# Altium project PowerSupplyPCB.PrjPcb
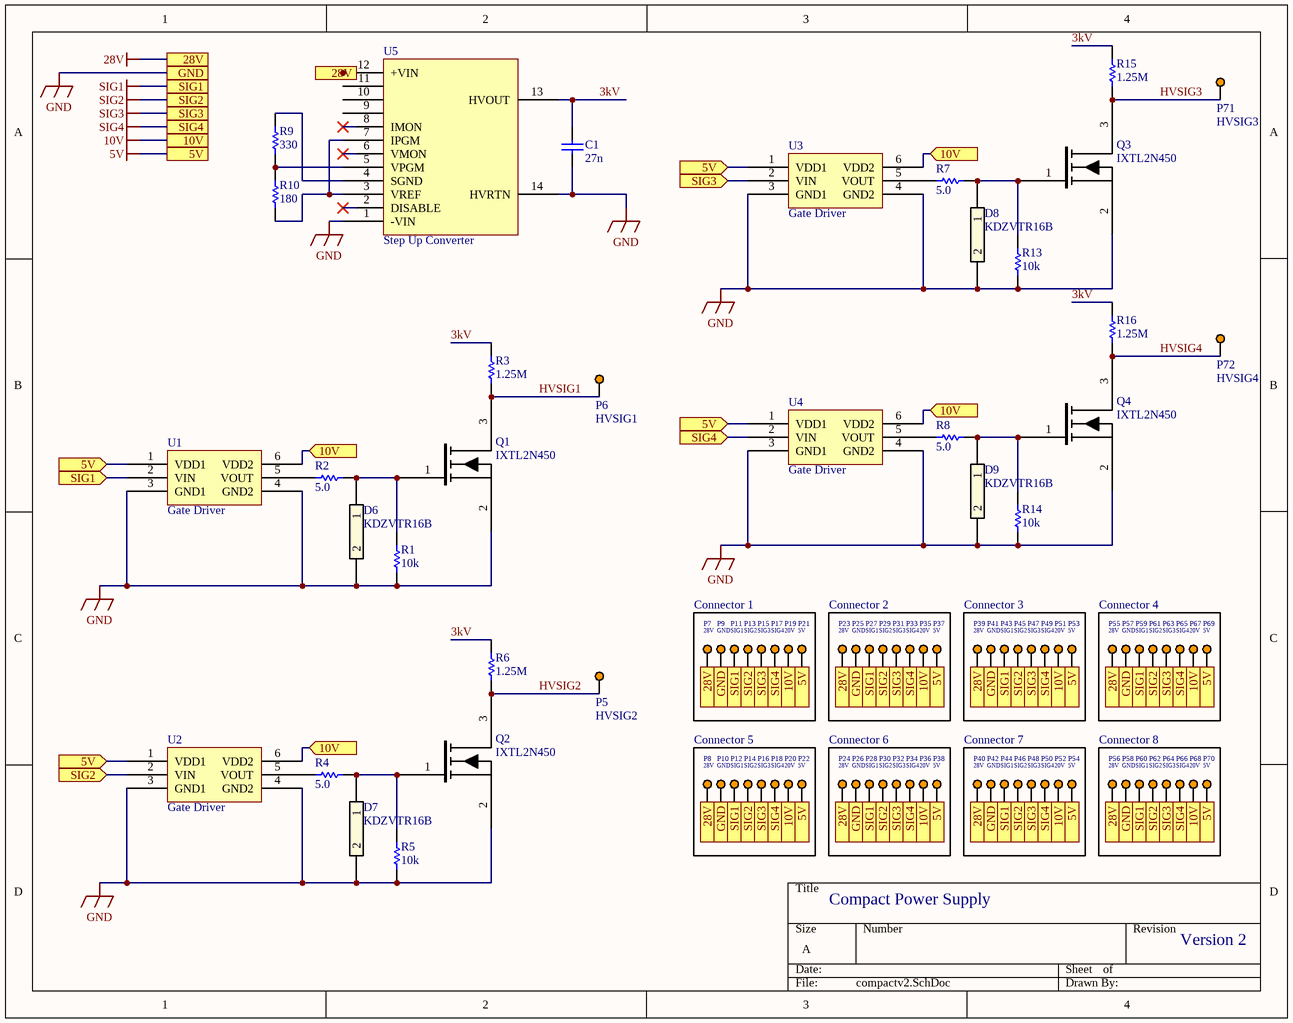
[diagram p0: compactv2.SchDoc]
3 sheets, 325 parts. Net scope: hierarchical (ports join the sheet entries above them; power ports are global).
Board files: benchtopv2-5.PcbDoc, compactv2.PcbDoc, benchtopv4.PcbDoc, compactv2-5_changed.PcbDoc, compactv2-5.PcbDoc
Sheets:
  compactv2.SchDoc
  benchtopv2.SchDoc
  compactv2-5.SchDoc

## Sheet compactv2.SchDoc
size A; SheetNumber: 1; SheetTotal: 3

### Parts
(Parts that share a designator on the sheet are numbered #1, #2 ... from top to bottom, then left to right.)
C1#1  27n  [HV Capacitor]
D6  KDZVTR16B  [Zener Diode]
D7  KDZVTR16B  [Zener Diode]
D8  KDZVTR16B  [Zener Diode]
D9  KDZVTR16B  [Zener Diode]
P5#1  HVSIG2  [Via]
P6#1  HVSIG1  [Via]
P7#1  28V  [Via]
P8#1  28V  [Via]
P9#1  GND  [Via]
P10#1  GND  [Via]
P11#1  SIG1  [Via]
P12#1  SIG1  [Via]
P13#1  SIG2  [Via]
P14#1  SIG2  [Via]
P15#1  SIG3  [Via]
P16#1  SIG3  [Via]
P17#1  SIG4  [Via]
P18#1  SIG4  [Via]
P19#1  20V  [Via]
P20#1  20V  [Via]
P21#1  5V  [Via]
P22#1  5V  [Via]
P23#1  28V  [Via]
P24#1  28V  [Via]
P25#1  GND  [Via]
P26#1  GND  [Via]
P27#1  SIG1  [Via]
P28#1  SIG1  [Via]
P29#1  SIG2  [Via]
P30#1  SIG2  [Via]
P31#1  SIG3  [Via]
P32#1  SIG3  [Via]
P33#1  SIG4  [Via]
P34#1  SIG4  [Via]
P35#1  20V  [Via]
P36#1  20V  [Via]
P37#1  5V  [Via]
P38#1  5V  [Via]
P39#1  28V  [Via]
P40#1  28V  [Via]
P41#1  GND  [Via]
P42#1  GND  [Via]
P43#1  SIG1  [Via]
P44#1  SIG1  [Via]
P45#1  SIG2  [Via]
P46#1  SIG2  [Via]
P47#1  SIG3  [Via]
P48#1  SIG3  [Via]
P49#1  SIG4  [Via]
P50#1  SIG4  [Via]
P51#1  20V  [Via]
P52#1  20V  [Via]
P53#1  5V  [Via]
P54#1  5V  [Via]
P55#1  28V  [Via]
P56#1  28V  [Via]
P57#1  GND  [Via]
P58#1  GND  [Via]
P59#1  SIG1  [Via]
P60#1  SIG1  [Via]
P61#1  SIG2  [Via]
P62#1  SIG2  [Via]
P63#1  SIG3  [Via]
P64#1  SIG3  [Via]
P65#1  SIG4  [Via]
P66#1  SIG4  [Via]
P67#1  20V  [Via]
P68#1  20V  [Via]
P69#1  5V  [Via]
P70#1  5V  [Via]
P71#1  HVSIG3  [Via]
P72#1  HVSIG4  [Via]
Q1#1  IXTL2N450  [MOSFET]
Q2#1  IXTL2N450  [MOSFET]
Q3#1  IXTL2N450  [MOSFET]
Q4#1  IXTL2N450  [MOSFET]
R1#1  10k  [LV Resistor]
R2#1  5.0  [Zener Resistor]
R3#1  1.25M  [LV Resistor]
R4#1  5.0  [Zener Resistor]
R5#1  10k  [LV Resistor]
R6#1  1.25M  [LV Resistor]
R7#1  5.0  [Zener Resistor]
R8#1  5.0  [Zener Resistor]
R9#1  330  [LV Resistor]
R10#1  180  [LV Resistor]
R13#1  10k  [LV Resistor]
R14#1  10k  [LV Resistor]
R15  1.25M  [LV Resistor]
R16  1.25M  [LV Resistor]
U1#1  Gate Driver  [Gate Driver]
U2#1  Gate Driver  [Gate Driver]
U3#1  Gate Driver  [Gate Driver]
U4#1  Gate Driver  [Gate Driver]
U5#1  Step Up Converter  [Step Up Converter]

### Blocks framed on the sheet
Connector 1: P7#1 P9#1 P11#1 P13#1 P15#1 P17#1 P19#1 P21#1
Connector 2: P23#1 P25#1 P27#1 P29#1 P31#1 P33#1 P35#1 P37#1
Connector 3: P39#1 P41#1 P43#1 P45#1 P47#1 P49#1 P51#1 P53#1
Connector 4: P55#1 P57#1 P59#1 P61#1 P63#1 P65#1 P67#1 P69#1
Connector 5: P8#1 P10#1 P12#1 P14#1 P16#1 P18#1 P20#1 P22#1
Connector 6: P24#1 P26#1 P28#1 P30#1 P32#1 P34#1 P36#1 P38#1
Connector 7: P40#1 P42#1 P44#1 P46#1 P48#1 P50#1 P52#1 P54#1
Connector 8: P56#1 P58#1 P60#1 P62#1 P64#1 P66#1 P68#1 P70#1

### Ports
5V, 5V (in), 10V, 10V (in), 28V, GND, SIG1, SIG1 (in), SIG2, SIG2 (in), SIG3, SIG3 (in), SIG4, SIG4 (in)

### Nets
5V: U1#1.1(VDD1) U2#1.1(VDD1) U3#1.1(VDD1) U4#1.1(VDD1) ; port 5V
10V: U1#1.6(VDD2) U2#1.6(VDD2) U3#1.6(VDD2) U4#1.6(VDD2) ; port 10V
28V: port 28V
GND: C1#1.1 D6.2 D7.2 D8.2 D9.2 Q1#1.2(S) Q2#1.2(S) Q3#1.2(S) Q4#1.2(S) R1#1.1 R5#1.1 R13#1.1 R14#1.1 U1#1.3(GND1) U1#1.4(GND2) U2#1.3(GND1) U2#1.4(GND2) U3#1.3(GND1) U3#1.4(GND2) U4#1.3(GND1) U4#1.4(GND2) U5#1.1(-VIN) U5#1.14(HVRTN) ; port GND
SIG1: U1#1.2(VIN) ; port SIG1
SIG2: U2#1.2(VIN) ; port SIG2
SIG3: U3#1.2(VIN) ; port SIG3
SIG4: U4#1.2(VIN) ; port SIG4
3kV: C1#1.2 R3#1.1 R6#1.1 R15.1 R16.1 U5#1.13(HVOUT)
HVSIG1: Q1#1.3(D) R3#1.2
HVSIG2: Q2#1.3(D) R6#1.2
HVSIG3: Q3#1.3(D) R15.2
HVSIG4: Q4#1.3(D) R16.2
NetD6_1: D6.1 Q1#1.1(G) R1#1.2 R2#1.1
NetD7_1: D7.1 Q2#1.1(G) R4#1.1 R5#1.2
NetD8_1: D8.1 Q3#1.1(G) R7#1.1 R13#1.2
NetD9_1: D9.1 Q4#1.1(G) R8#1.1 R14#1.2
NetR2#1_2: R2#1.2 U1#1.5(VOUT)
NetR4#1_2: R4#1.2 U2#1.5(VOUT)
NetR7#1_2: R7#1.2 U3#1.5(VOUT)
NetR8#1_2: R8#1.2 U4#1.5(VOUT)
NetR9#1_1: R9#1.1 U5#1.4(SGND)
NetR9#1_2: R9#1.2 R10#1.1 U5#1.5(VPGM)
NetR10#1_2: R10#1.2 U5#1.3(VREF) U5#1.7(IPGM)

Not connected (* = marked no-connect by the designer): P5#1 1; P6#1 1; P7#1 1; P8#1 1; P9#1 1; P10#1 1; P11#1 1; P12#1 1; P13#1 1; P14#1 1; P15#1 1; P16#1 1; P17#1 1; P18#1 1; P19#1 1; P20#1 1; P21#1 1; P22#1 1; P23#1 1; P24#1 1; P25#1 1; P26#1 1; P27#1 1; P28#1 1; P29#1 1; P30#1 1; P31#1 1; P32#1 1; P33#1 1; P34#1 1; P35#1 1; P36#1 1; P37#1 1; P38#1 1; P39#1 1; P40#1 1; P41#1 1; P42#1 1; P43#1 1; P44#1 1; P45#1 1; P46#1 1; P47#1 1; P48#1 1; P49#1 1; P50#1 1; P51#1 1; P52#1 1; P53#1 1; P54#1 1; P55#1 1; P56#1 1; P57#1 1; P58#1 1; P59#1 1; P60#1 1; P61#1 1; P62#1 1; P63#1 1; P64#1 1; P65#1 1; P66#1 1; P67#1 1; P68#1 1; P69#1 1; P70#1 1; P71#1 1; P72#1 1; U5#1 2(DISABLE)* 6(VMON)* 8(IMON)* 9 10 11 12(+VIN)

### Notes on the sheet
- Compact Power Supply
- Version 2

### Library data of the parts
C1#1 = Capacitor
D6-D9 = Zener Diode: Vendor: ROHM Semiconductor; Built_By: EMA_Matt; SourceLibrary: Rohm_2019-09-23; Type: DEV; Manufacturer_Part_Number: KDZVTR16B; Copyright: Copyright (C) 2018 Accelerated Designs. All rights reserved; RefDes: RefDes
P5#1 P6#1 P7#1 P8#1 P9#1 P10#1 P11#1 P12#1 P13#1 P14#1 P15#1 P16#1 P17#1 P18#1 P19#1 P20#1 P21#1 P22#1 P23#1 P24#1 P25#1 P26#1 P27#1 P28#1 P29#1 P30#1 P31#1 P32#1 P33#1 P34#1 P35#1 P36#1 P37#1 P38#1 P39#1 P40#1 P41#1 P42#1 P43#1 P44#1 P45#1 P46#1 P47#1 P48#1 P49#1 P50#1 P51#1 P52#1 P53#1 P54#1 P55#1 P56#1 P57#1 P58#1 P59#1 P60#1 P61#1 P62#1 P63#1 P64#1 P65#1 P66#1 P67#1 P68#1 P69#1 P70#1 P71#1 P72#1 = Output Point: Thru hole via
Q1#1 Q2#1 Q3#1 Q4#1 = MOSFET: IXTL2N4X0
R1#1 R2#1 R3#1 R4#1 R5#1 R6#1 R7#1 R8#1 R9#1 R10#1 R13#1 R14#1 R15 R16 = Resistor
U1#1 U2#1 U3#1 U4#1 = Gate Driver: ADuM4120
U5#1 = Step Up Converter: HRL30

## Sheet benchtopv2.SchDoc
size A; SheetNumber: 2; SheetTotal: 2
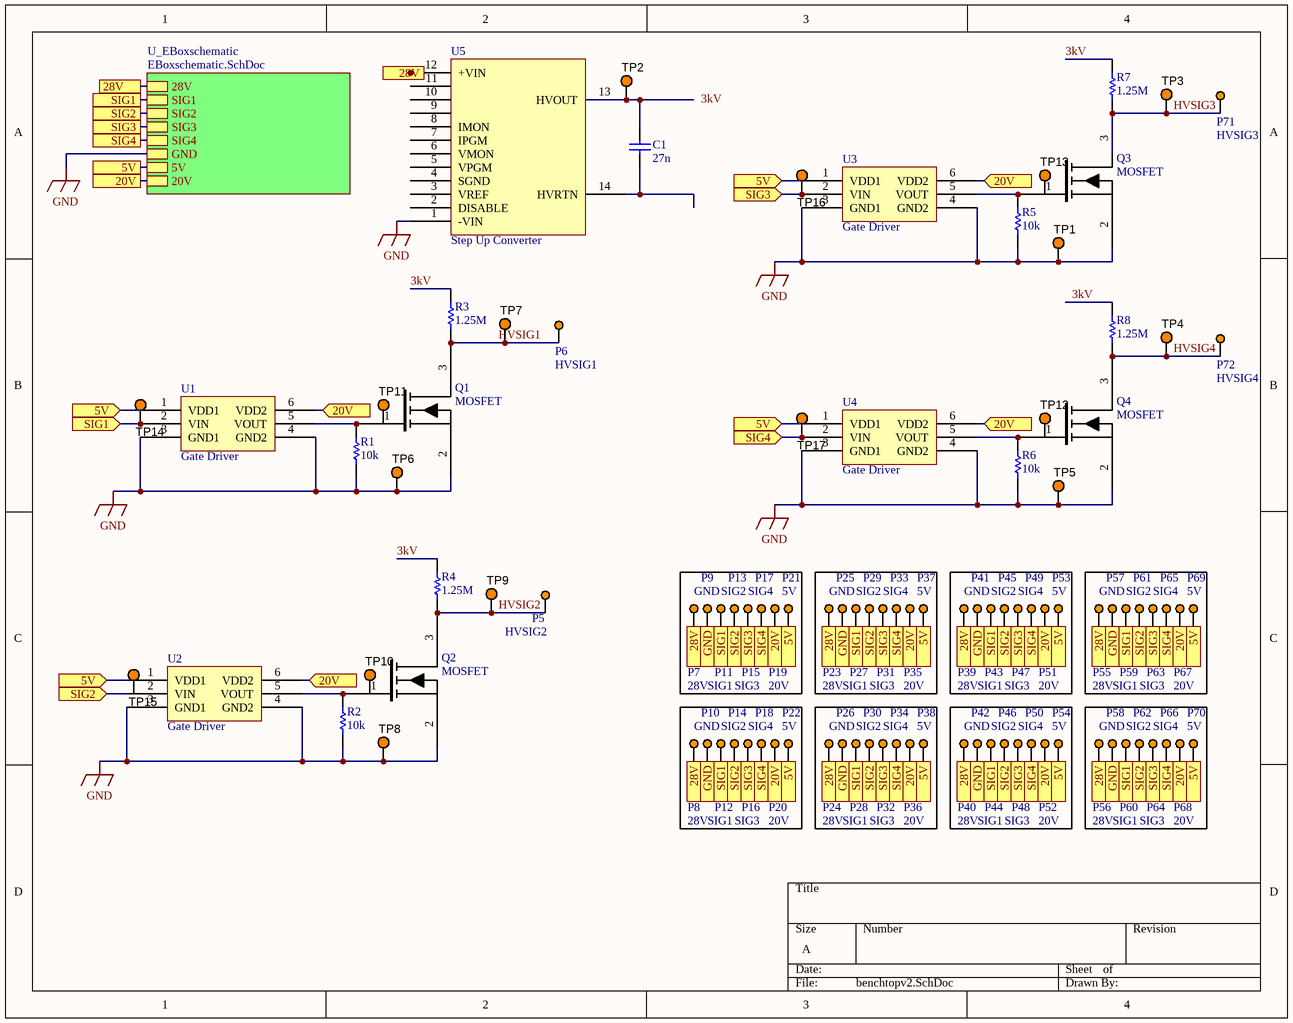
[diagram p1: benchtopv2.SchDoc]

### Parts
(Parts that share a designator on the sheet are numbered #1, #2 ... from top to bottom, then left to right.)
C1#2  27n  [HV Capacitor]
P5#2  HVSIG2  [Via]
P6#2  HVSIG1  [Via]
P7#2  28V  [Via]
P8#2  28V  [Via]
P9#2  GND  [Via]
P10#2  GND  [Via]
P11#2  SIG1  [Via]
P12#2  SIG1  [Via]
P13#2  SIG2  [Via]
P14#2  SIG2  [Via]
P15#2  SIG3  [Via]
P16#2  SIG3  [Via]
P17#2  SIG4  [Via]
P18#2  SIG4  [Via]
P19#2  20V  [Via]
P20#2  20V  [Via]
P21#2  5V  [Via]
P22#2  5V  [Via]
P23#2  28V  [Via]
P24#2  28V  [Via]
P25#2  GND  [Via]
P26#2  GND  [Via]
P27#2  SIG1  [Via]
P28#2  SIG1  [Via]
P29#2  SIG2  [Via]
P30#2  SIG2  [Via]
P31#2  SIG3  [Via]
P32#2  SIG3  [Via]
P33#2  SIG4  [Via]
P34#2  SIG4  [Via]
P35#2  20V  [Via]
P36#2  20V  [Via]
P37#2  5V  [Via]
P38#2  5V  [Via]
P39#2  28V  [Via]
P40#2  28V  [Via]
P41#2  GND  [Via]
P42#2  GND  [Via]
P43#2  SIG1  [Via]
P44#2  SIG1  [Via]
P45#2  SIG2  [Via]
P46#2  SIG2  [Via]
P47#2  SIG3  [Via]
P48#2  SIG3  [Via]
P49#2  SIG4  [Via]
P50#2  SIG4  [Via]
P51#2  20V  [Via]
P52#2  20V  [Via]
P53#2  5V  [Via]
P54#2  5V  [Via]
P55#2  28V  [Via]
P56#2  28V  [Via]
P57#2  GND  [Via]
P58#2  GND  [Via]
P59#2  SIG1  [Via]
P60#2  SIG1  [Via]
P61#2  SIG2  [Via]
P62#2  SIG2  [Via]
P63#2  SIG3  [Via]
P64#2  SIG3  [Via]
P65#2  SIG4  [Via]
P66#2  SIG4  [Via]
P67#2  20V  [Via]
P68#2  20V  [Via]
P69#2  5V  [Via]
P70#2  5V  [Via]
P71#2  HVSIG3  [Via]
P72#2  HVSIG4  [Via]
Q1#2  MOSFET  [MOSFET]
Q2#2  MOSFET  [MOSFET]
Q3#2  MOSFET  [MOSFET]
Q4#2  MOSFET  [MOSFET]
R1#2  10k  [LV Resistor]
R2#2  10k  [LV Resistor]
R3#2  1.25M  [HV resistor]
R4#2  1.25M  [HV resistor]
R5#2  10k  [LV Resistor]
R6#2  10k  [LV Resistor]
R7#2  1.25M  [HV resistor]
R8#2  1.25M  [HV resistor]
TP1  5003  [KSTN-5003]  (value not drawn)
TP2  5003  [KSTN-5003]  (value not drawn)
TP3  5003  [KSTN-5003]  (value not drawn)
TP4  5003  [KSTN-5003]  (value not drawn)
TP5  5003  [KSTN-5003]  (value not drawn)
TP6  5003  [KSTN-5003]  (value not drawn)
TP7  5003  [KSTN-5003]  (value not drawn)
TP8  5003  [KSTN-5003]  (value not drawn)
TP9  5003  [KSTN-5003]  (value not drawn)
TP10  5003  [KSTN-5003]  (value not drawn)
TP11  5003  [KSTN-5003]  (value not drawn)
TP12  5003  [KSTN-5003]  (value not drawn)
TP13  5003  [KSTN-5003]  (value not drawn)
TP14  5003  [KSTN-5003]  (value not drawn)
TP15  5003  [KSTN-5003]  (value not drawn)
TP16  5003  [KSTN-5003]  (value not drawn)
TP17  5003  [KSTN-5003]  (value not drawn)
U1#2  Gate Driver  [Gate Driver]
U2#2  Gate Driver  [Gate Driver]
U3#2  Gate Driver  [Gate Driver]
U4#2  Gate Driver  [Gate Driver]
U5#2  Step Up Converter  [Step Up Converter]

### Sub-sheets
U_EBoxschematic = EBoxschematic.SchDoc (file not in this document): 28V, SIG1, SIG2, SIG3, SIG4, GND, 5V, 20V

### Ports
5V, 5V (in), 20V, 20V (in), 28V, GND, SIG1, SIG1 (in), SIG2, SIG2 (in), SIG3, SIG3 (in), SIG4, SIG4 (in)

### Nets
GND: Q1#2.2(S) Q2#2.2(S) Q3#2.2(S) Q4#2.2(S) R1#2.1 R2#2.1 R5#2.1 R6#2.1 TP1.1 TP5.1 TP6.1 TP8.1 U1#2.3(GND1) U1#2.4(GND2) U2#2.3(GND1) U2#2.4(GND2) U3#2.3(GND1) U3#2.4(GND2) U4#2.3(GND1) U4#2.4(GND2) U5#2.1(-VIN) ; sheet U_EBoxschematic/GND
3kV: R3#2.1 R4#2.1 R7#2.1 R8#2.1
HVSIG1: Q1#2.3(D) R3#2.2 TP7.1
HVSIG2: Q2#2.3(D) R4#2.2 TP9.1
HVSIG3: Q3#2.3(D) R7#2.2 TP3.1
HVSIG4: Q4#2.3(D) R8#2.2 TP4.1
NetC1#2_1: C1#2.1 U5#2.14(HVRTN)
NetC1#2_2: C1#2.2 TP2.1 U5#2.13(HVOUT)
NetQ1#2_1: Q1#2.1(G) R1#2.2 U1#2.5(VOUT)
NetQ2#2_1: Q2#2.1(G) R2#2.2 U2#2.5(VOUT)
NetQ3#2_1: Q3#2.1(G) R5#2.2 U3#2.5(VOUT)
NetQ4#2_1: Q4#2.1(G) R6#2.2 U4#2.5(VOUT)
NetTP14_1: TP14.1 U1#2.2(VIN) ; port SIG1, sheet U_EBoxschematic/SIG1
NetTP16_1: TP16.1 U3#2.2(VIN) ; port SIG3, sheet U_EBoxschematic/SIG3
NetTP17_1: TP17.1 U4#2.2(VIN) ; port SIG4, sheet U_EBoxschematic/SIG4
NetU1#2_1: U1#2.1(VDD1) U2#2.1(VDD1) U3#2.1(VDD1) U4#2.1(VDD1) ; port 5V, sheet U_EBoxschematic/5V
NetU1#2_6: U1#2.6(VDD2) U2#2.6(VDD2) U3#2.6(VDD2) U4#2.6(VDD2) ; port 20V, sheet U_EBoxschematic/20V
NetU2#2_2: U2#2.2(VIN) ; port SIG2, sheet U_EBoxschematic/SIG2
(unnamed): port 28V, sheet U_EBoxschematic/28V

Not connected (* = marked no-connect by the designer): P5#2 1; P6#2 1; P7#2 1; P8#2 1; P9#2 1; P10#2 1; P11#2 1; P12#2 1; P13#2 1; P14#2 1; P15#2 1; P16#2 1; P17#2 1; P18#2 1; P19#2 1; P20#2 1; P21#2 1; P22#2 1; P23#2 1; P24#2 1; P25#2 1; P26#2 1; P27#2 1; P28#2 1; P29#2 1; P30#2 1; P31#2 1; P32#2 1; P33#2 1; P34#2 1; P35#2 1; P36#2 1; P37#2 1; P38#2 1; P39#2 1; P40#2 1; P41#2 1; P42#2 1; P43#2 1; P44#2 1; P45#2 1; P46#2 1; P47#2 1; P48#2 1; P49#2 1; P50#2 1; P51#2 1; P52#2 1; P53#2 1; P54#2 1; P55#2 1; P56#2 1; P57#2 1; P58#2 1; P59#2 1; P60#2 1; P61#2 1; P62#2 1; P63#2 1; P64#2 1; P65#2 1; P66#2 1; P67#2 1; P68#2 1; P69#2 1; P70#2 1; P71#2 1; P72#2 1; TP10 1; TP11 1; TP12 1; TP13 1; TP15 1; U5#2 2(DISABLE) 3(VREF) 4(SGND) 5(VPGM) 6(VMON) 7(IPGM) 8(IMON) 9 10 11 12(+VIN)

### Notes on the sheet
- Labels drawn without touching a wire or pin: 3kV

### Library data of the parts
C1#2 = Capacitor
P5#2 P6#2 P7#2 P8#2 P9#2 P10#2 P11#2 P12#2 P13#2 P14#2 P15#2 P16#2 P17#2 P18#2 P19#2 P20#2 P21#2 P22#2 P23#2 P24#2 P25#2 P26#2 P27#2 P28#2 P29#2 P30#2 P31#2 P32#2 P33#2 P34#2 P35#2 P36#2 P37#2 P38#2 P39#2 P40#2 P41#2 P42#2 P43#2 P44#2 P45#2 P46#2 P47#2 P48#2 P49#2 P50#2 P51#2 P52#2 P53#2 P54#2 P55#2 P56#2 P57#2 P58#2 P59#2 P60#2 P61#2 P62#2 P63#2 P64#2 P65#2 P66#2 P67#2 P68#2 P69#2 P70#2 P71#2 P72#2 = Output Point: Thru hole via
Q1#2 Q2#2 Q3#2 Q4#2 = MOSFET: IXTL2N4X0
R1#2 R2#2 R3#2 R4#2 R5#2 R6#2 R7#2 R8#2 = Resistor
TP1-TP17 = CMP-002-00037-2: Test Point, Orange, Height 4.6 mm, Tail Length 3 mm, 1-Pin THD, RoHS; Manufacturer: Keystone; Colour: Orange; Packaging: Bulk; Package Description: 1-Pin Through Hole Device, Dia 2.54 mm; Pins: 1; Package Reference: 5003; Datasheet Version: Jun-15; Case/Package: 5003; Mounting Technology: TH; Connector Type: TestPoint; Diameter: 2.54mm; Contact Material: Bronze; Datasheet URL: http://keyelco.com/userAssets/file/M65p56.pdf; Manufacturer URL: http://www.keyelco.com/; Package Quantity: 10; Contact Plating: Tin; RoHS Compliant: True
U1#2 U2#2 U3#2 U4#2 = Gate Driver: ADuM4120
U5#2 = Step Up Converter: HRL30

## Sheet compactv2-5.SchDoc
size A; SheetNumber: 3; SheetTotal: 3
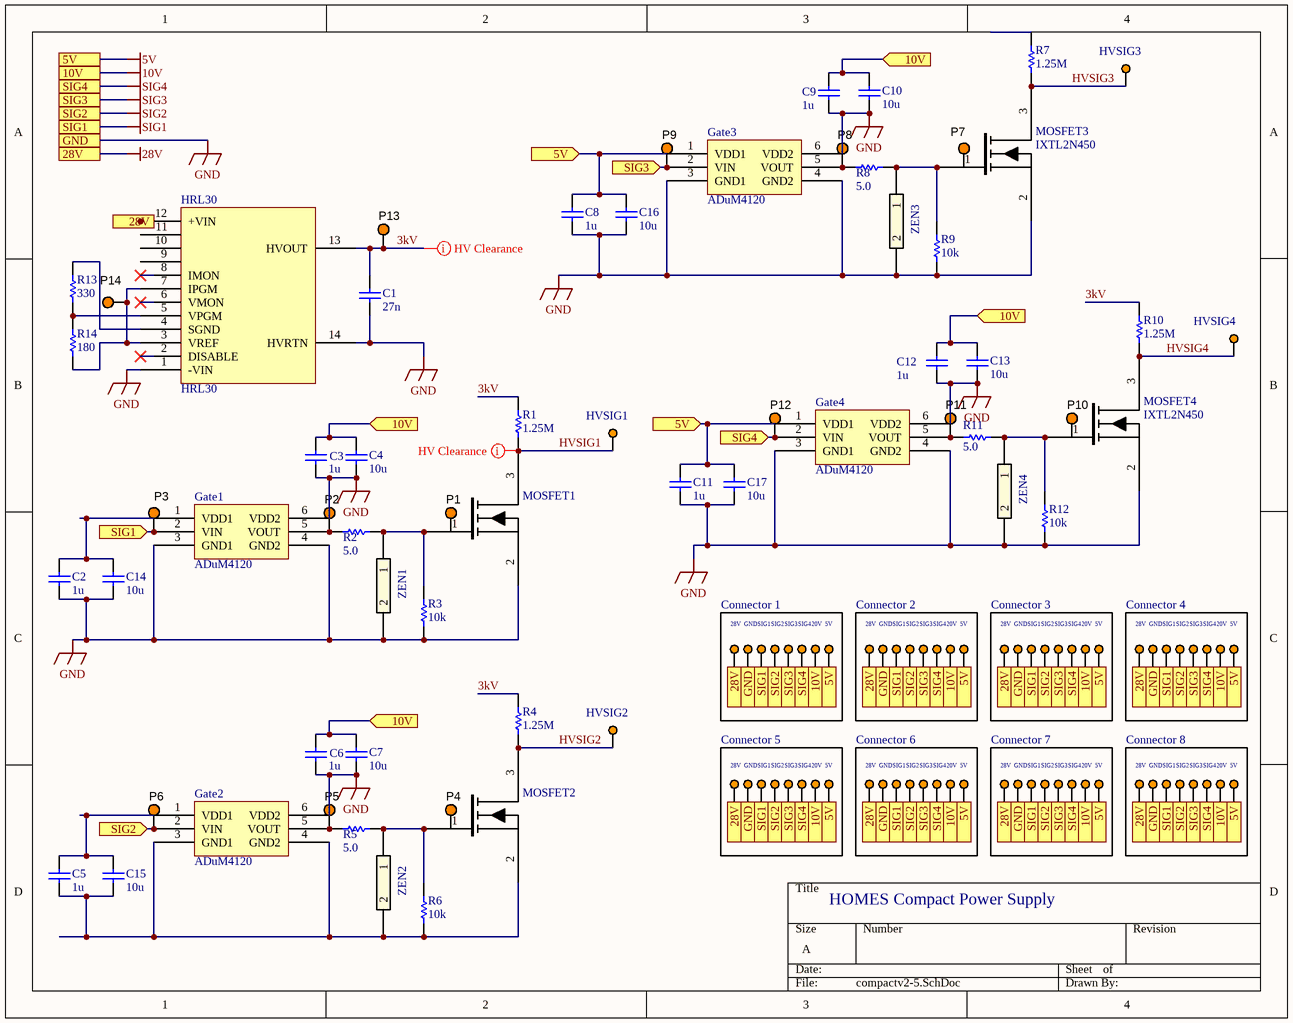
[diagram p2: compactv2-5.SchDoc]

### Parts
(Parts that share a designator on the sheet are numbered #1, #2 ... from top to bottom, then left to right.)
?#1  HVSIG4  [Via]
?#2  HVSIG1  [Via]
?#3  MOSFET1  [MOSFET]
?#4  MOSFET2  [MOSFET]
C1#3  27n  [HV Capacitor]
C2  1u  [1uF Ceramic Capacitor]
C3  1u  [1uF Ceramic Capacitor]
C4  10u  [10uF Ceramic Capacitor]
C5  1u  [1uF Ceramic Capacitor]
C6  1u  [1uF Ceramic Capacitor]
C7  10u  [10uF Ceramic Capacitor]
C8  1u  [1uF Ceramic Capacitor]
C9  1u  [1uF Ceramic Capacitor]
C10  10u  [10uF Ceramic Capacitor]
C11  1u  [1uF Ceramic Capacitor]
C12  1u  [1uF Ceramic Capacitor]
C13  10u  [10uF Ceramic Capacitor]
C14  10u  [10uF Ceramic Capacitor]
C15  10u  [10uF Ceramic Capacitor]
C16  10u  [10uF Ceramic Capacitor]
C17  10u  [10uF Ceramic Capacitor]
Gate1  ADuM4120  [Gate Driver]
Gate2  ADuM4120  [Gate Driver]
Gate3  ADuM4120  [Gate Driver]
Gate4  ADuM4120  [Gate Driver]
HRL30  HRL30  [Step Up Converter]
MOSFET3  IXTL2N450  [MOSFET]
MOSFET4  IXTL2N450  [MOSFET]
P1  5003  [KSTN-5003]  (value not drawn)
P2  5003  [KSTN-5003]  (value not drawn)
P3  5003  [KSTN-5003]  (value not drawn)
P4  5003  [KSTN-5003]  (value not drawn)
P5#3  5003  [KSTN-5003]  (value not drawn)
P6#3  5003  [KSTN-5003]  (value not drawn)
P7#3  5003  [KSTN-5003]  (value not drawn)
P8#3  5003  [KSTN-5003]  (value not drawn)
P9#3  5003  [KSTN-5003]  (value not drawn)
P10#3  5003  [KSTN-5003]  (value not drawn)
P11#3  5003  [KSTN-5003]  (value not drawn)
P12#3  5003  [KSTN-5003]  (value not drawn)
P13#3  5003  [KSTN-5003]  (value not drawn)
P14#3  5003  [KSTN-5003]  (value not drawn)
P?#1  HVSIG3  [Via]
P?#2  28V  [Via]
P?#3  GND  [Via]
P?#4  SIG1  [Via]
P?#5  SIG2  [Via]
P?#6  SIG3  [Via]
P?#7  SIG4  [Via]
P?#8  20V  [Via]
P?#9  5V  [Via]
P?#10  28V  [Via]
P?#11  GND  [Via]
P?#12  SIG1  [Via]
P?#13  SIG2  [Via]
P?#14  SIG3  [Via]
P?#15  SIG4  [Via]
P?#16  20V  [Via]
P?#17  5V  [Via]
P?#18  28V  [Via]
P?#19  GND  [Via]
P?#20  SIG1  [Via]
P?#21  SIG2  [Via]
P?#22  SIG3  [Via]
P?#23  SIG4  [Via]
P?#24  20V  [Via]
P?#25  5V  [Via]
P?#26  28V  [Via]
P?#27  GND  [Via]
P?#28  SIG1  [Via]
P?#29  SIG2  [Via]
P?#30  SIG3  [Via]
P?#31  SIG4  [Via]
P?#32  20V  [Via]
P?#33  5V  [Via]
P?#34  HVSIG2  [Via]
P?#35  28V  [Via]
P?#36  GND  [Via]
P?#37  SIG1  [Via]
P?#38  SIG2  [Via]
P?#39  SIG3  [Via]
P?#40  SIG4  [Via]
P?#41  20V  [Via]
P?#42  5V  [Via]
P?#43  28V  [Via]
P?#44  GND  [Via]
P?#45  SIG1  [Via]
P?#46  SIG2  [Via]
P?#47  SIG3  [Via]
P?#48  SIG4  [Via]
P?#49  20V  [Via]
P?#50  5V  [Via]
P?#51  28V  [Via]
P?#52  GND  [Via]
P?#53  SIG1  [Via]
P?#54  SIG2  [Via]
P?#55  SIG3  [Via]
P?#56  SIG4  [Via]
P?#57  20V  [Via]
P?#58  5V  [Via]
P?#59  28V  [Via]
P?#60  GND  [Via]
P?#61  SIG1  [Via]
P?#62  SIG2  [Via]
P?#63  SIG3  [Via]
P?#64  SIG4  [Via]
P?#65  20V  [Via]
P?#66  5V  [Via]
R1#3  1.25M  [LV Resistor]
R2#3  5.0  [Zener Resistor]
R3#3  10k  [LV Resistor]
R4#3  1.25M  [LV Resistor]
R5#3  5.0  [Zener Resistor]
R6#3  10k  [LV Resistor]
R7#3  1.25M  [LV Resistor]
R8#3  5.0  [Zener Resistor]
R9#2  10k  [LV Resistor]
R10#2  1.25M  [LV Resistor]
R11  5.0  [Zener Resistor]
R12  10k  [LV Resistor]
R13#2  330  [LV Resistor]
R14#2  180  [LV Resistor]
ZEN1  (no value)  [Zener Diode]
ZEN2  KDZVTR16B  [Zener Diode]  (value not drawn)
ZEN3  KDZVTR16B  [Zener Diode]  (value not drawn)
ZEN4  KDZVTR16B  [Zener Diode]  (value not drawn)

### Blocks framed on the sheet
Connector 1: P?#2-P?#9
Connector 2: P?#10-P?#17
Connector 3: P?#18-P?#25
Connector 4: P?#26-P?#33
Connector 5: P?#35-P?#42
Connector 6: P?#43-P?#50
Connector 7: P?#51-P?#58
Connector 8: P?#59-P?#66

### Ports
5V, 5V (in), 10V, 10V (in), 28V, GND, SIG1, SIG1 (in), SIG2, SIG2 (in), SIG3, SIG3 (in), SIG4, SIG4 (in)

### Nets
5V: C8.2 C11.2 C16.2 C17.2 Gate3.1(VDD1) Gate4.1(VDD1) ; port 5V
10V: C3.2 C4.2 C6.2 C7.2 C9.2 C10.2 C12.2 C13.2 ; port 10V
28V: port 28V
GND: ?#3.2(S) C1#3.1 C2.1 C3.1 C4.1 C6.1 C7.1 C8.1 C9.1 C10.1 C11.1 C12.1 C13.1 C14.1 C16.1 C17.1 Gate1.3(GND1) Gate1.4(GND2) Gate1.6(VDD2) Gate2.6(VDD2) Gate3.3(GND1) Gate3.4(GND2) Gate3.6(VDD2) Gate4.3(GND1) Gate4.4(GND2) Gate4.6(VDD2) HRL30.1(-VIN) HRL30.14(HVRTN) MOSFET3.2(S) MOSFET4.2(S) R3#3.1 R9#2.1 R12.1 ZEN1.2 ZEN3.2 ZEN4.2 ; port GND
SIG1: Gate1.2(VIN) P3.1 ; port SIG1
SIG2: Gate2.2(VIN) P6#3.1 ; port SIG2
SIG3: Gate3.2(VIN) P9#3.1 ; port SIG3
SIG4: Gate4.2(VIN) P12#3.1 ; port SIG4
3kV: C1#3.2 HRL30.13(HVOUT) P13#3.1 R1#3.1 R4#3.1 R10#2.1
HVSIG1: ?#3.3(D) R1#3.2
HVSIG2: ?#4.3(D) R4#3.2
HVSIG3: MOSFET3.3(D) R7#3.2
HVSIG4: MOSFET4.3(D) R10#2.2
Net?#3_1: ?#3.1(G) R2#3.1 R3#3.2 ZEN1.1
Net?#4_1: ?#4.1(G) R5#3.1 R6#3.2 ZEN2.1
Net?#4_2: ?#4.2(S) C5.1 C15.1 Gate2.3(GND1) Gate2.4(GND2) R6#3.1 ZEN2.2
NetC2_2: C2.2 C14.2 Gate1.1(VDD1)
NetC5_2: C5.2 C15.2 Gate2.1(VDD1)
NetGate1_5: Gate1.5(VOUT) P2.1 R2#3.2
NetGate2_5: Gate2.5(VOUT) P5#3.1 R5#3.2
NetGate3_5: Gate3.5(VOUT) P8#3.1 R8#3.2
NetGate4_5: Gate4.5(VOUT) P11#3.1 R11.2
NetHRL30_3: HRL30.3(VREF) HRL30.7(IPGM) P14#3.1 R14#2.2
NetHRL30_4: HRL30.4(SGND) R13#2.1
NetHRL30_5: HRL30.5(VPGM) R13#2.2 R14#2.1
NetMOSFET3_1: MOSFET3.1(G) R8#3.1 R9#2.2 ZEN3.1
NetMOSFET4_1: MOSFET4.1(G) R11.1 R12.2 ZEN4.1

Not connected (* = marked no-connect by the designer): ?#1 1; ?#2 1; HRL30 2(DISABLE)* 6(VMON)* 8(IMON)* 9 10 11 12(+VIN); P1 1; P4 1; P7#3 1; P10#3 1; P?#1 1; P?#2 1; P?#3 1; P?#4 1; P?#5 1; P?#6 1; P?#7 1; P?#8 1; P?#9 1; P?#10 1; P?#11 1; P?#12 1; P?#13 1; P?#14 1; P?#15 1; P?#16 1; P?#17 1; P?#18 1; P?#19 1; P?#20 1; P?#21 1; P?#22 1; P?#23 1; P?#24 1; P?#25 1; P?#26 1; P?#27 1; P?#28 1; P?#29 1; P?#30 1; P?#31 1; P?#32 1; P?#33 1; P?#34 1; P?#35 1; P?#36 1; P?#37 1; P?#38 1; P?#39 1; P?#40 1; P?#41 1; P?#42 1; P?#43 1; P?#44 1; P?#45 1; P?#46 1; P?#47 1; P?#48 1; P?#49 1; P?#50 1; P?#51 1; P?#52 1; P?#53 1; P?#54 1; P?#55 1; P?#56 1; P?#57 1; P?#58 1; P?#59 1; P?#60 1; P?#61 1; P?#62 1; P?#63 1; P?#64 1; P?#65 1; P?#66 1; R7#3 1

### Layout directives
rule Clearance Constraint [Generic clearance = 10mil, and 26 value(s) for objects]: 3kV, HVSIG1

### Notes on the sheet
- HOMES Compact Power Supply

### Library data of the parts
?#1 ?#2 P?#1-P?#66 = Output Point: Thru hole via
?#3 ?#4 MOSFET3 MOSFET4 = MOSFET: IXTL2N4X0
C1#3 C2-C17 = Capacitor
Gate1-Gate4 = Gate Driver
HRL30 = Step Up Converter
P1-P4 P5#3 P6#3 P7#3 P8#3 P9#3 P10#3 P11#3 P12#3 P13#3 P14#3 = CMP-002-00037-2: as TP1 on sheet benchtopv2; Colour: Orange; Packaging: Bulk; Package Description: 1-Pin Through Hole Device, Dia 2.54 mm; Pins: 1; Package Reference: 5003; Datasheet Version: Jun-15; Case/Package: 5003; Mounting Technology: TH; Connector Type: TestPoint; Diameter: 2.54mm; Contact Material: Bronze; Datasheet URL: http://keyelco.com/userAssets/file/M65p56.pdf; Manufacturer URL: http://www.keyelco.com/; Package Quantity: 10; Contact Plating: Tin; RoHS Compliant: True
R1#3 R2#3 R3#3 R4#3 R5#3 R6#3 R7#3 R8#3 R9#2 R10#2 R11 R12 R13#2 R14#2 = Resistor
ZEN1 = Zener Diode: Manufacturer_Part_Number: KDZVTR16B; Vendor: ROHM Semiconductor; Built_By: EMA_Matt; SourceLibrary: Rohm_2019-09-23; Copyright: Copyright (C) 2018 Accelerated Designs. All rights reserved; RefDes: RefDes; Type: DEV
ZEN2-ZEN4 = Zener Diode: Vendor: ROHM Semiconductor; Built_By: EMA_Matt; SourceLibrary: Rohm_2019-09-23; Manufacturer_Part_Number: KDZVTR16B; Copyright: Copyright (C) 2018 Accelerated Designs. All rights reserved; RefDes: RefDes; Type: DEV

## Nets that join several sheets
5V: compactv2 (U1#1.1 U2#1.1 U3#1.1 U4#1.1), compactv2-5 (6 pins)
10V: compactv2 (U1#1.6 U2#1.6 U3#1.6 U4#1.6), compactv2-5 (8 pins)
GND: compactv2 (23 pins), benchtopv2 (21 pins), compactv2-5 (36 pins)
SIG1: compactv2 (U1#1.2), compactv2-5 (Gate1.2 P3.1)
SIG2: compactv2 (U2#1.2), compactv2-5 (Gate2.2 P6#3.1)
SIG3: compactv2 (U3#1.2), compactv2-5 (Gate3.2 P9#3.1)
SIG4: compactv2 (U4#1.2), compactv2-5 (Gate4.2 P12#3.1)